# Altium schematic sheet Sheet_1_2020-06-17_10-56-25.schdoc
size 62 x 58 mm
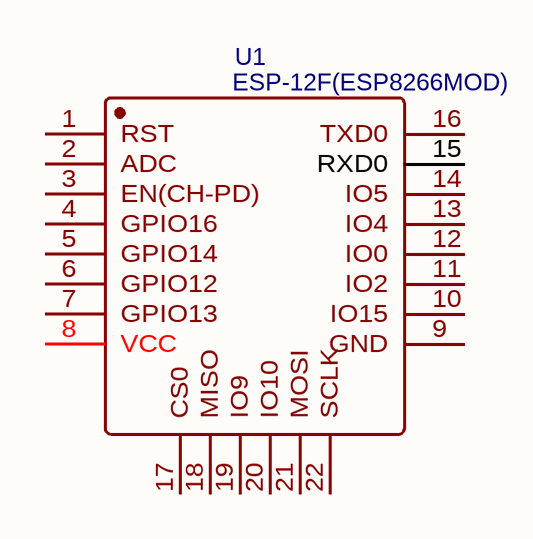
[diagram p0: Sheet_1_2020-06-17_10-56-25.schdoc]

## Parts
U1  ESP-12F(ESP8266MOD)  [WIFIM-SMD_ESP-12F-ESP8266MOD]

## Nets

Not connected (* = marked no-connect by the designer): U1 1(RST) 2(ADC) 3(EN(CH-PD)) 4(GPIO16) 5(GPIO14) 6(GPIO12) 7(GPIO13) 8(VCC) 9(GND) 10(IO15) 11(IO2) 12(IO0) 13(IO4) 14(IO5) 15(RXD0) 16(TXD0) 17(CS0) 18(MISO) 19(IO9) 20(IO10) 21(MOSI) 22(SCLK)

## Library data of the parts
U1 = ESP-12F(ESP8266MOD): BOM_Manufacturer: Ai-Thinker; BOM_Supplier: LCSC; BOM_Manufacturer Part: ESP-12F(ESP8266MOD); BOM_Supplier Part: C82891; spicePre: U; spiceSymbolName: ESP-12F(ESP8266MOD)